# Altium project SwingTubeMagnetBracket.PrjPCB
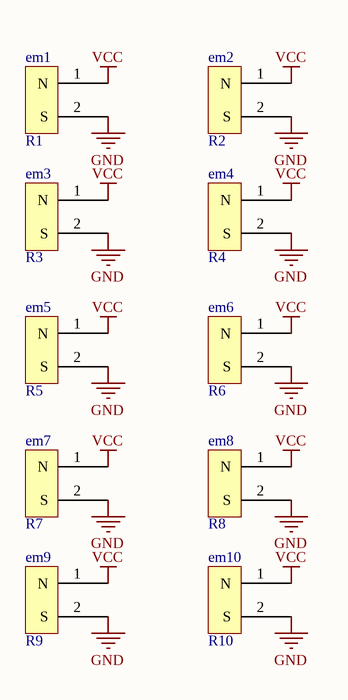
[diagram p0: main.SchDoc]
1 sheet, 10 parts. Net scope: global (net labels, ports and power ports of the same name join across sheets).
Board file: main.PcbDoc

## Sheet main.SchDoc
size A4

### Parts
em1  R1  [electromagnet]
em2  R2  [electromagnet]
em3  R3  [electromagnet]
em4  R4  [electromagnet]
em5  R5  [electromagnet]
em6  R6  [electromagnet]
em7  R7  [electromagnet]
em8  R8  [electromagnet]
em9  R9  [electromagnet]
em10  R10  [electromagnet]

### Nets
GND: em1.2(S) em2.2(S) em3.2(S) em4.2(S) em5.2(S) em6.2(S) em7.2(S) em8.2(S) em9.2(S) em10.2(S)
VCC: em1.1(N) em2.1(N) em3.1(N) em4.1(N) em5.1(N) em6.1(N) em7.1(N) em8.1(N) em9.1(N) em10.1(N)

### Library data of the parts
em1-em10 = electromagnet